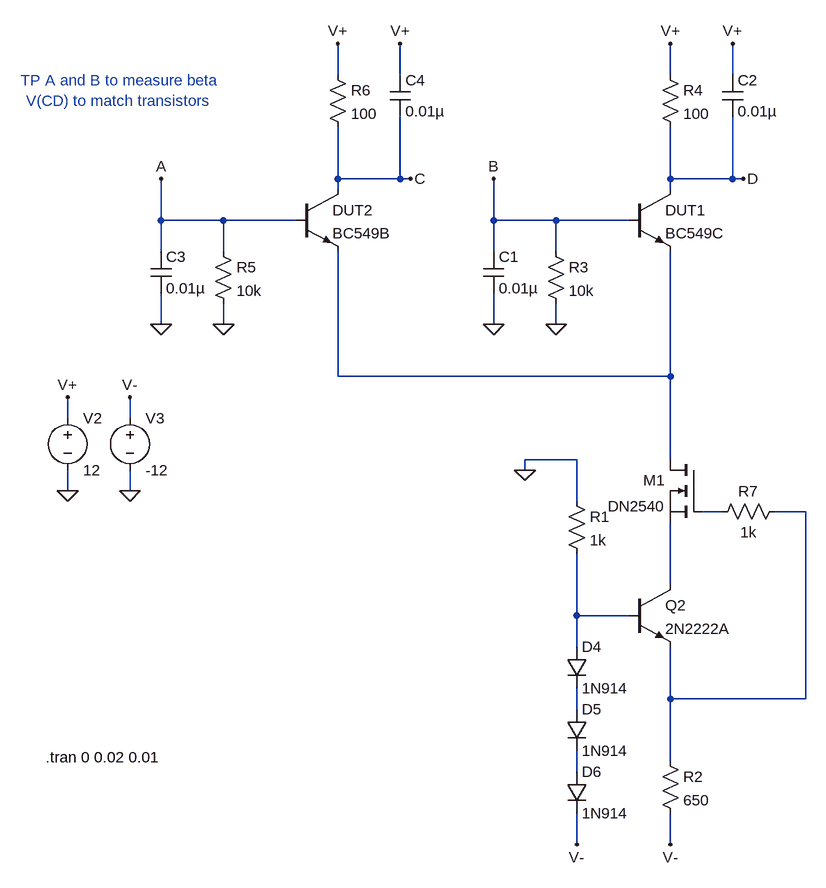
[diagram p0: schematic TransistorMatcher.asc]
TransistorMatcher.asc, the LTspice schematic file:
Version 4
SHEET 1 1600 920
WIRE -288 -624 -288 -672
WIRE -192 -624 -192 -672
WIRE 224 -624 224 -672
WIRE 320 -624 320 -672
WIRE -288 -464 -288 -544
WIRE -192 -464 -192 -560
WIRE -192 -464 -288 -464
WIRE -176 -464 -192 -464
WIRE 224 -464 224 -544
WIRE 320 -464 320 -560
WIRE 320 -464 224 -464
WIRE 336 -464 320 -464
WIRE -288 -448 -288 -464
WIRE 224 -448 224 -464
WIRE -560 -400 -560 -464
WIRE -464 -400 -560 -400
WIRE -352 -400 -464 -400
WIRE -48 -400 -48 -464
WIRE 48 -400 -48 -400
WIRE 160 -400 48 -400
WIRE -560 -352 -560 -400
WIRE -464 -352 -464 -400
WIRE -48 -352 -48 -400
WIRE 48 -352 48 -400
WIRE -560 -240 -560 -288
WIRE -464 -240 -464 -272
WIRE -48 -240 -48 -288
WIRE 48 -240 48 -272
WIRE -288 -160 -288 -352
WIRE 224 -160 224 -352
WIRE 224 -160 -288 -160
WIRE -704 -96 -704 -128
WIRE -608 -96 -608 -128
WIRE 80 -32 0 -32
WIRE 224 -32 224 -160
WIRE 0 -16 0 -32
WIRE -704 16 -704 -16
WIRE -608 16 -608 -16
WIRE 80 32 80 -32
WIRE 304 48 272 48
WIRE 432 48 384 48
WIRE 224 160 224 64
WIRE 80 208 80 112
WIRE 160 208 80 208
WIRE 80 256 80 208
WIRE 224 336 224 256
WIRE 432 336 432 48
WIRE 432 336 224 336
WIRE 80 352 80 320
WIRE 224 432 224 336
WIRE 80 448 80 416
WIRE 80 560 80 512
WIRE 224 560 224 512
FLAG 0 -16 0
FLAG 48 -240 0
FLAG -48 -240 0
FLAG 320 -672 V+
FLAG 224 -672 V+
FLAG 224 560 V-
FLAG 80 560 V-
FLAG -464 -240 0
FLAG -560 -240 0
FLAG -192 -672 V+
FLAG -288 -672 V+
FLAG -608 16 0
FLAG -704 16 0
FLAG -704 -128 V+
FLAG -608 -128 V-
FLAG -560 -464 A
FLAG -48 -464 B
FLAG -176 -464 C
FLAG 336 -464 D
SYMBOL res 64 16 R0
SYMATTR InstName R1
SYMATTR Value 1k
SYMBOL res 208 416 R0
SYMATTR InstName R2
SYMATTR Value 650
SYMBOL npn 160 -448 R0
SYMATTR InstName DUT1
SYMATTR Value BC549C
SYMBOL res 32 -368 R0
SYMATTR InstName R3
SYMATTR Value 10k
SYMBOL cap -64 -352 R0
SYMATTR InstName C1
SYMATTR Value 0.01µ
SYMBOL res 208 -640 R0
SYMATTR InstName R4
SYMATTR Value 100
SYMBOL cap 304 -624 R0
SYMATTR InstName C2
SYMATTR Value 0.01µ
SYMBOL npn -352 -448 R0
SYMATTR InstName DUT2
SYMATTR Value BC549B
SYMBOL res -480 -368 R0
SYMATTR InstName R5
SYMATTR Value 10k
SYMBOL cap -576 -352 R0
SYMATTR InstName C3
SYMATTR Value 0.01µ
SYMBOL res -304 -640 R0
SYMATTR InstName R6
SYMATTR Value 100
SYMBOL cap -208 -624 R0
SYMATTR InstName C4
SYMATTR Value 0.01µ
SYMBOL voltage -704 -112 R0
WINDOW 123 0 0 Left 0
WINDOW 39 0 0 Left 0
SYMATTR InstName V2
SYMATTR Value 12
SYMBOL voltage -608 -112 R0
WINDOW 123 0 0 Left 0
WINDOW 39 0 0 Left 0
SYMATTR InstName V3
SYMATTR Value -12
SYMBOL npn 160 160 R0
SYMATTR InstName Q2
SYMATTR Value 2N2222A
SYMBOL diode 64 256 R0
SYMATTR InstName D4
SYMATTR Value 1N914
SYMBOL diode 64 352 R0
SYMATTR InstName D5
SYMATTR Value 1N914
SYMBOL diode 64 448 R0
SYMATTR InstName D6
SYMATTR Value 1N914
SYMBOL nmos 272 -32 M0
SYMATTR InstName M1
SYMATTR Value DN2540
SYMBOL res 400 32 R90
WINDOW 0 0 56 VBottom 2
WINDOW 3 32 56 VTop 2
SYMATTR InstName R7
SYMATTR Value 1k
TEXT -738 426 Left 2 !.tran 0 0.02 0.01
TEXT -776 -616 Left 2 ;TP A and B to measure beta
TEXT -768 -584 Left 2 ;V(CD) to match transistors

The netlist it stands for:
* TransistorMatcher.asc
R1 0 N005 1k
R2 N003 V- 650
Q§DUT1 D B N001 0 BC549C
R3 B 0 10k
C1 B 0 0.01µ
R4 V+ D 100
C2 V+ D 0.01µ
Q§DUT2 C A N001 0 BC549B
R5 A 0 10k
C3 A 0 0.01µ
R6 V+ C 100
C4 V+ C 0.01µ
V2 V+ 0 12
V3 V- 0 -12
Q2 N004 N005 N003 0 2N2222A
D4 N005 N006 1N914
D5 N006 N007 1N914
D6 N007 V- 1N914
M1 N001 N002 N004 N004 DN2540
R7 N003 N002 1k
.model D D
.lib standard.dio
.model NPN NPN
.model PNP PNP
.lib standard.bjt
.model NMOS NMOS
.model PMOS PMOS
.lib standard.mos
.tran 0 0.02 0.01
* TP A and B to measure beta
* V(CD) to match transistors
.backanno
.end